# EAGLE design canmotor (EAGLE 9.6.2)
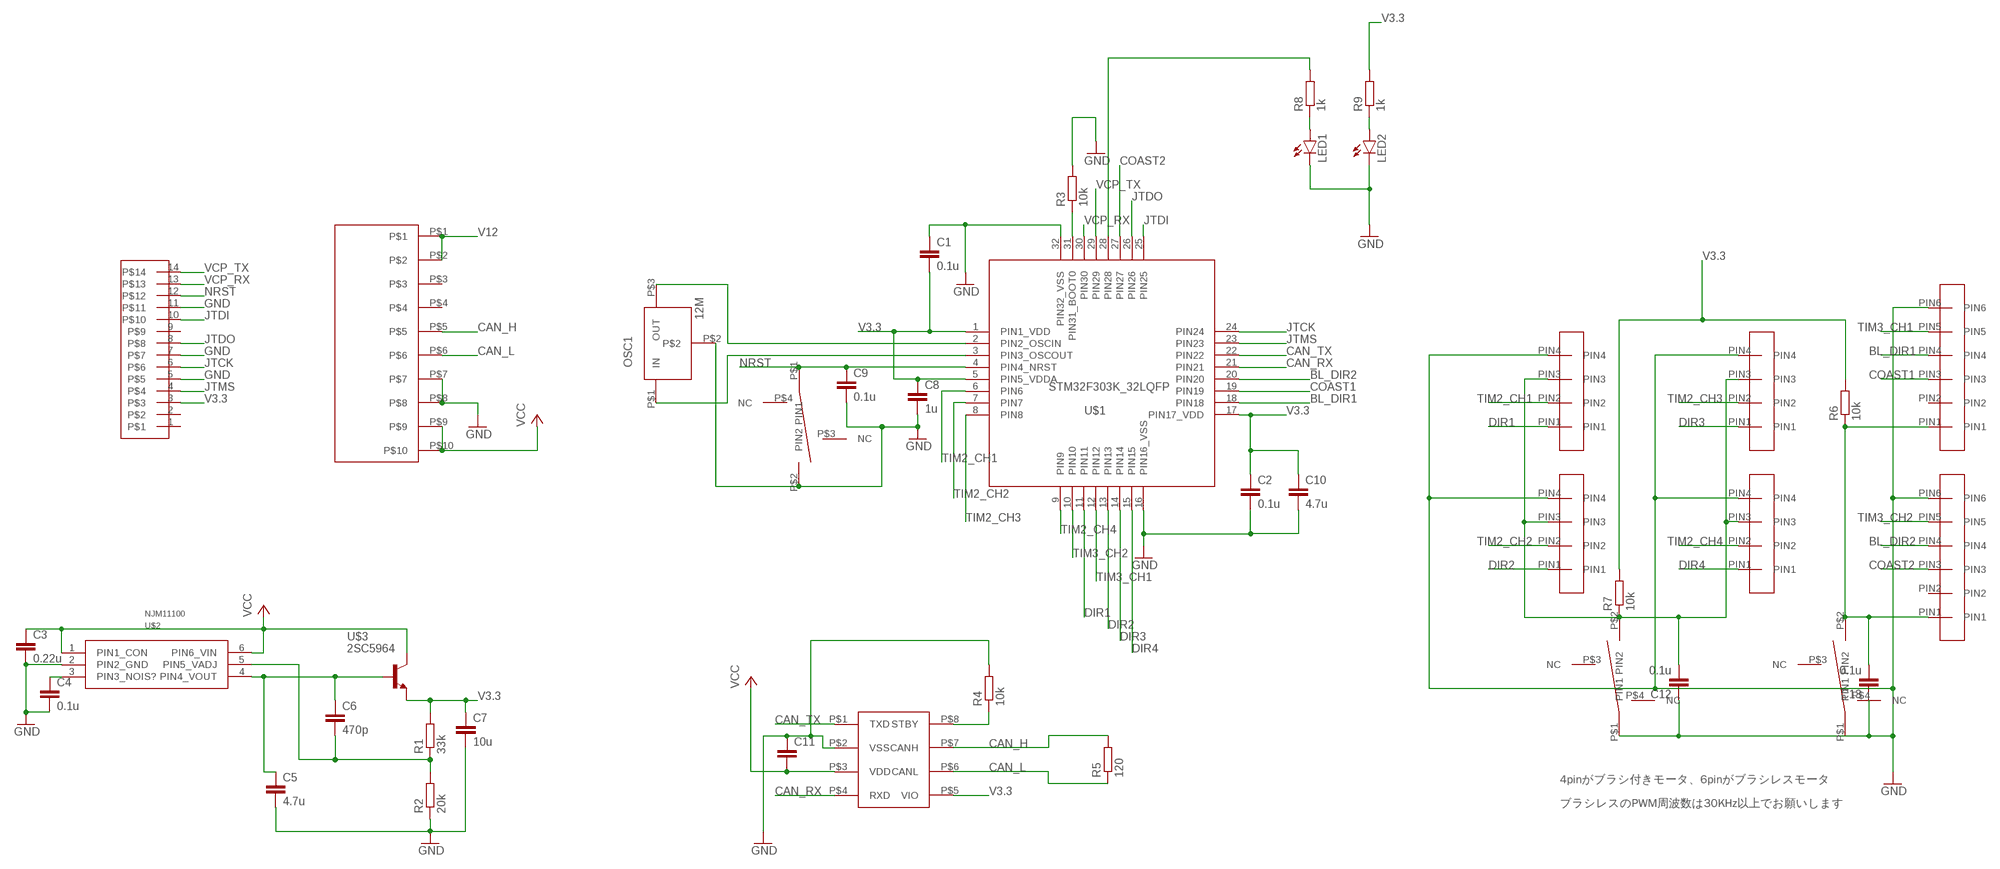
[diagram p0: schematic, sheet 1]

## Parts
BOX10P-L2  BOX10PBOX10P-L  [BOX10P-L]
C1  0.1u  C-EUC1608  [C1608]
C2  0.1u  C-EUC1608  [C1608]
C3  0.22u  C-EUC2012  [C2012]
C4  0.1u  C-EUC1608  [C1608]
C5  4.7u  C-EUC2012  [C2012]
C6  470p  C-EUC1608  [C1608]
C7  10u  C-EUC2012  [C2012]
C8  1u  C-EUC1608  [C1608]
C9  0.1u  C-EUC1608  [C1608]
C10  4.7u  C-EUC2012  [C2012]
C11  C-EUC1608  [C1608]
C12  0.1u  C-EUC1608  [C1608]
C13  0.1u  C-EUC1608  [C1608]
LED1  1608LED  [1608]
LED2  1608LED  [1608]
OSC1  12M  CSTN#  [CSTNE#]
R1  33k  R_REG  [1608]
R2  20k  R_REG  [1608]
R3  10k  R_REG  [1608]
R4  10k  R_REG  [1608]
R5  120  R_REG  [1608]
R6  10k  R_REG  [1608]
R7  10k  R_REG  [1608]
R8  1k  R_REG  [1608]
R9  1k  R_REG  [1608]
U$1  STM32F303K_32LQFP  [LQFP32-7X7]
U$2  NJM11100  [SOT23-6]
U$3  2SC5964  [PCP]
U$4  TAKUTOSUITTI2  [TAKUTOSUITTI2]
U$5  MCP2562MCP2561-SN  [SOIC8]
U$6  BOX14P  [CON_HEDA14P_1.27]
U$7  DF1B_L_6P  [DF1B_L_6P]
U$8  DF1B_L_4P  [DF1B_L_4P]
U$9  DF1B_L_4P  [DF1B_L_4P]
U$10  DF1B_L_4P  [DF1B_L_4P]
U$11  DF1B_L_4P  [DF1B_L_4P]
U$12  DF1B_L_6P  [DF1B_L_6P]
U$13  TAKUTOSUITTI2  [TAKUTOSUITTI2]
U$14  TAKUTOSUITTI2  [TAKUTOSUITTI2]

## Nets
BL_DIR1: U$1.18(PIN18) U$7.PIN4
BL_DIR2: U$1.20(PIN20) U$12.PIN4
CAN_H: BOX10P-L2.P$5 R5.2 U$5.P$7(CANH)
CAN_L: BOX10P-L2.P$6 R5.1 U$5.P$6(CANL)
CAN_RX: U$1.21(PIN21) U$5.P$4(RXD)
CAN_TX: U$1.22(PIN22) U$5.P$1(TXD)
COAST1: U$1.19(PIN19) U$7.PIN3
COAST2: U$1.27(PIN27) U$12.PIN3
DIR1: U$1.11(PIN11) U$8.PIN1
DIR2: U$1.13(PIN13) U$9.PIN1
DIR3: U$1.14(PIN14) U$10.PIN1
DIR4: U$1.15(PIN15) U$11.PIN1
GND: BOX10P-L2.P$7 BOX10P-L2.P$8 C1.1 C2.2 C3.2 C4.2 C5.2 C7.2 C8.2 C9.2 C10.2 C11.1 C12.1 C13.1 LED1.K LED2.K OSC1.P$2 R2.1 R3.2 R4.2 U$1.16(PIN16_VSS) U$1.32(PIN32_VSS) U$2.2(PIN2_GND) U$4.P$2(PIN2) U$5.P$2(VSS) U$6.5 U$6.7 U$6.11 U$7.PIN6 U$8.PIN4 U$9.PIN4 U$10.PIN4 U$11.PIN4 U$12.PIN6 U$13.P$1(PIN1) U$14.P$1(PIN1)
JTCK: U$1.24(PIN24) U$6.6
JTDI: U$1.25(PIN25) U$6.10
JTDO: U$1.26(PIN26) U$6.8
JTMS: U$1.23(PIN23) U$6.4
N$1: C6.2 R1.1 R2.2 U$2.5(PIN5_VADJ)
N$2: C4.1 U$2.3(PIN3_NOIS?)
N$3: C5.1 C6.1 U$2.4(PIN4_VOUT) U$3.1(B)
N$4: OSC1.P$1(IN) U$1.3(PIN3_OSCOUT)
N$5: OSC1.P$3(OUT) U$1.2(PIN2_OSCIN)
N$6: R3.1 U$1.31(PIN31_BOOT0)
N$7: C12.2 R7.1 U$8.PIN3 U$9.PIN3 U$10.PIN3 U$11.PIN3 U$14.P$2(PIN2)
N$9: R4.1 U$5.P$8(STBY)
N$10: C13.2 R6.1 U$7.PIN1 U$12.PIN1 U$13.P$2(PIN2)
N$11: LED1.A R8.1
N$12: LED2.A R9.1
N$14: R8.2 U$1.28(PIN28)
NRST: C9.1 U$1.4(PIN4_NRST) U$4.P$1(PIN1) U$6.12
TIM2_CH1: U$1.6(PIN6) U$8.PIN2
TIM2_CH2: U$1.7(PIN7) U$9.PIN2
TIM2_CH3: U$1.8(PIN8) U$10.PIN2
TIM2_CH4: U$1.9(PIN9) U$11.PIN2
TIM3_CH1: U$1.12(PIN12) U$7.PIN5
TIM3_CH2: U$1.10(PIN10) U$12.PIN5
V3.3: C1.2 C2.1 C7.1 C8.1 C10.1 R1.2 R6.2 R7.2 R9.2 U$1.1(PIN1_VDD) U$1.5(PIN5_VDDA) U$1.17(PIN17_VDD) U$3.3(E) U$5.P$5(VIO) U$6.3
V12: BOX10P-L2.P$1 BOX10P-L2.P$2
VCC: BOX10P-L2.P$9 BOX10P-L2.P$10 C3.1 C11.2 U$2.1(PIN1_CON) U$2.6(PIN6_VIN) U$3.2(C) U$3.2@2(C) U$5.P$3(VDD)
VCP_RX: U$1.30(PIN30) U$6.13
VCP_TX: U$1.29(PIN29) U$6.14
Unconnected: BOX10P-L2.P$3 BOX10P-L2.P$4 U$4.P$3(NC) U$4.P$4(NC) U$6.1 U$6.2 U$6.9 U$7.PIN2 U$12.PIN2 U$13.P$3(NC) U$13.P$4(NC) U$14.P$3(NC) U$14.P$4(NC)

## Notes on the sheet
- 4pinがブラシ付きモータ、6pinがブラシレスモータ
- ブラシレスのPWM周波数は30KHz以上でお願いします

## Library data of the parts
BOX10P-L2 = user_conector:BOX10P
C1-C13 = rcl:C-EU: CAPACITOR, European symbol; SPICEPREFIX: C
LED1 LED2 = user_leds:1608LED: 1608LED
OSC1 = user_osc:CSTN#: ムラタのセラロック （セラミック振動子） 周波数はいくつか種類あり(valueで設定して) 秋月電子通商のトップ/パーツ一般/発振子/セラミック発振子 uCからのoutが入るのがinであることに注意 https://akizukidenshi.com/catalog/c/cceralock/
R1-R9 = user_rcl:R_REG: 1608パッケージのチップ抵抗 ガッコのリールの抵抗はたぶんこれ
U$1 = user_ic:STM32F303K_32LQFP
U$2 = user_ic:NJM11100: 可変型レギュレータ 秋月電子[I-06655]
U$3 = user_tr_fet_igbt:2SC5964: rs品番774-0746 PCP
U$4 U$13 U$14 = user_swich:TAKUTOSUITTI2
U$5 = user_ic:MCP2562
U$6 = user_conector:BOX14P
U$7 U$12 = user_conector:DF1B_L_6P
U$8-U$11 = user_conector:DF1B_L_4P

## Board
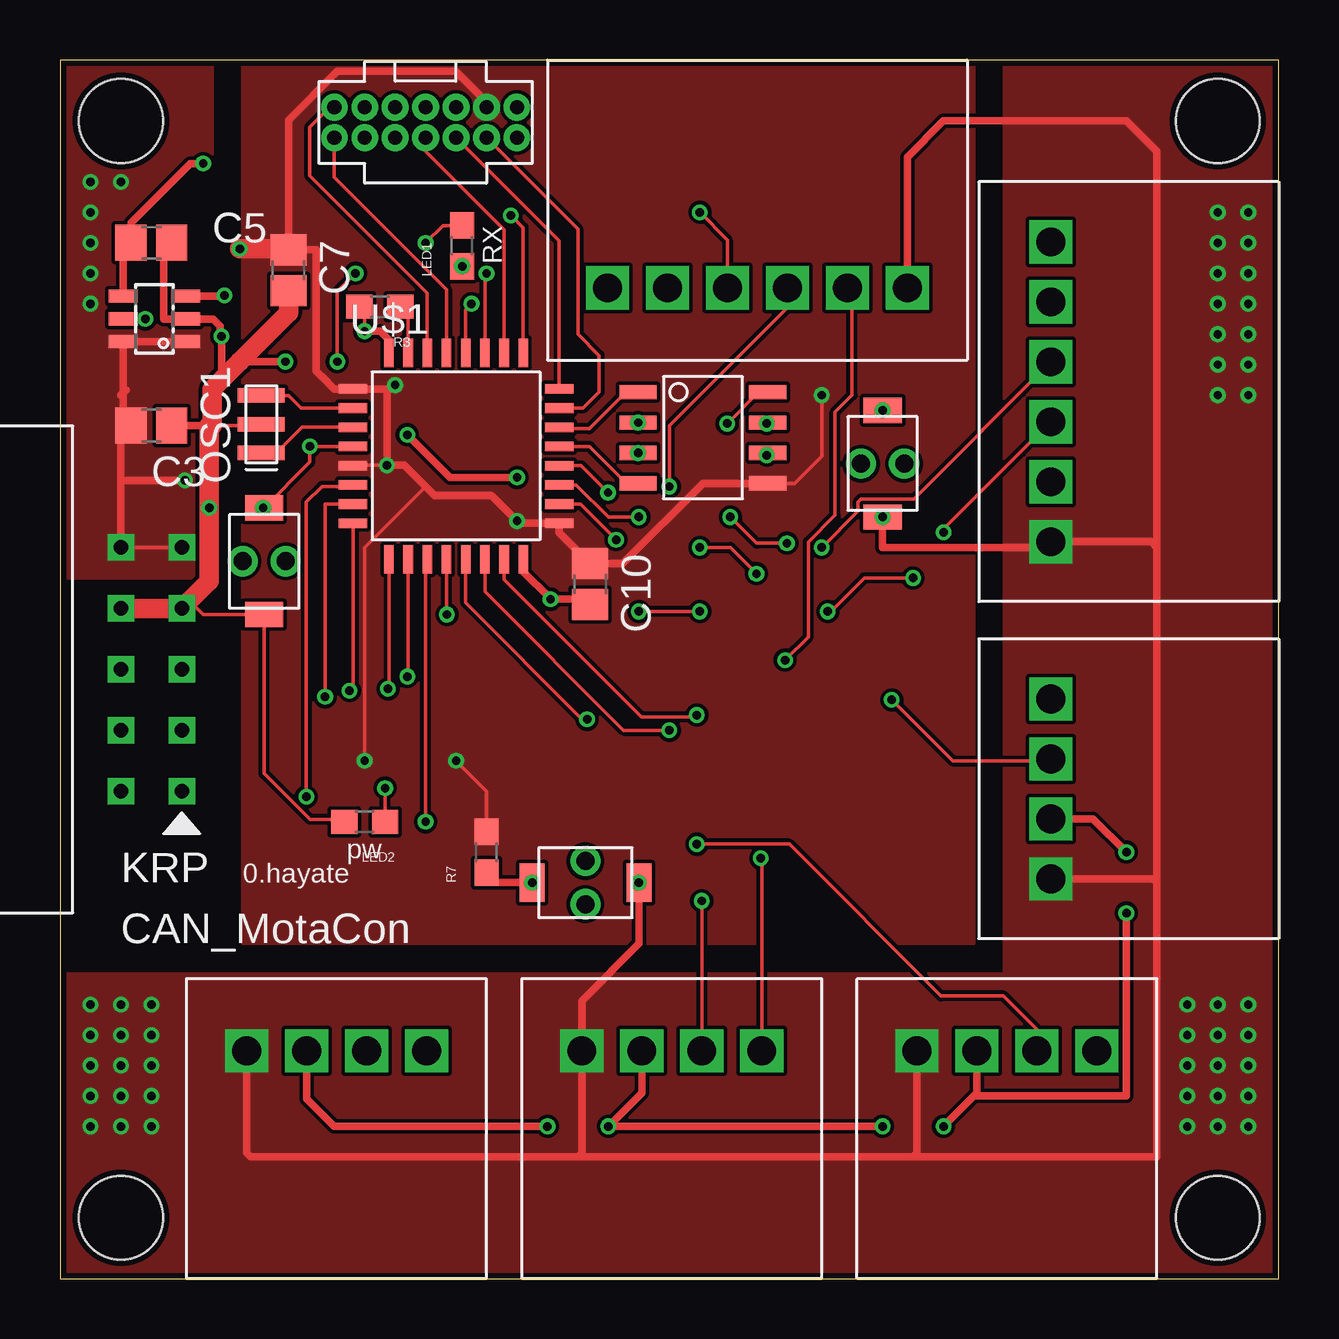
[diagram p1: board, top side]
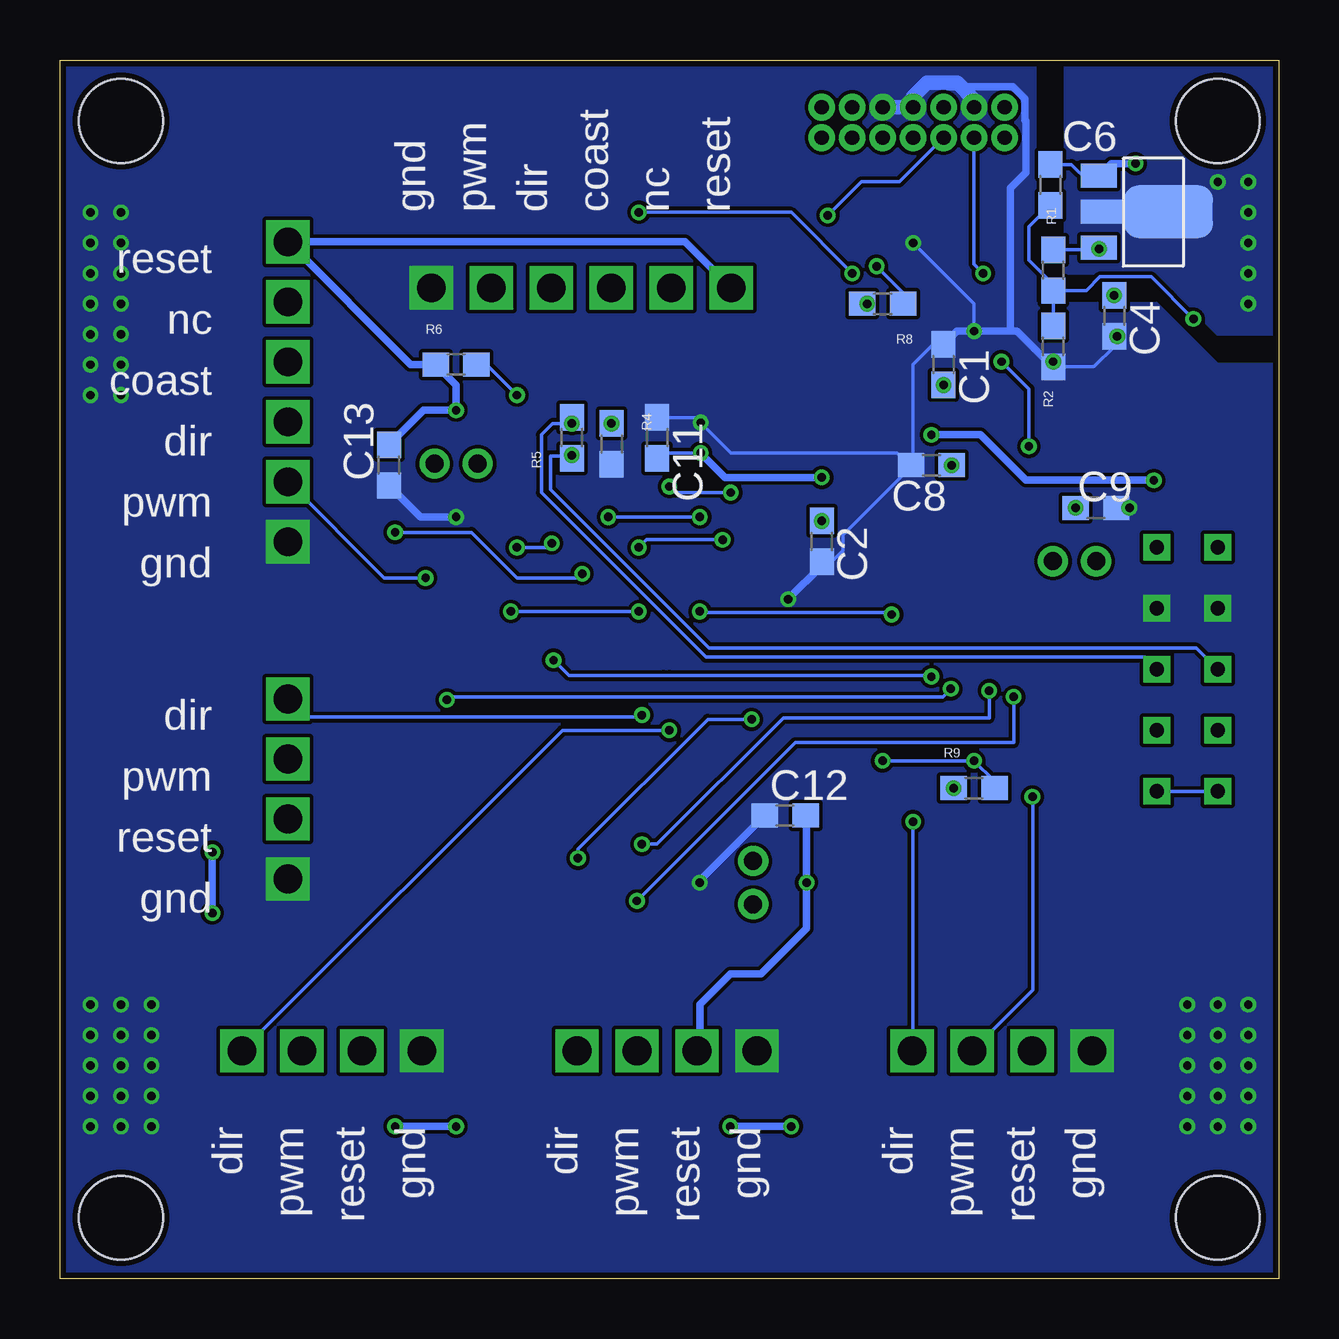
[diagram p2: board, bottom side, seen from below]

Size 50.8 x 50.8 mm. Coordinates in mm from the lower left corner, seen from the top.
Outline: 0,0 50.8,0 50.8,50.8 0,50.8 0,0
Copper layers (1*16): Top 0.035mm / dielectric 1.5mm / Bottom 0.035mm
Design rules "SeeedStudio_2layer_DRU_no_angle_20140221": minimum track width 6mil, minimum drill 12mil, track to track 6mil, track to pad 6mil, pad to pad 6mil, via to via 6mil, smd to smd 0mil, copper to edge 10mil, drill to drill 10mil, minimum pad ring 10mil, minimum via ring 6mil, stop-mask expansion 2mil, vias tented up to drill 100mil, thermal gap 10mil
Holes 3.5 mm at 2.54,48.26 48.26,48.26 48.26,2.54 2.54,2.54

### Footprints (pad centres in the part's own frame; a part is rotated, then mirrored left to right if it is on the bottom)
BOX10P-L = drill 0.6 square: P$1 5.08,2.54; P$2 5.08,0; P$3 2.54,2.54; P$4 2.54,0; P$5 0,2.54; P$6 0,0; P$7 -2.54,2.54; P$8 -2.54,0; P$9 -5.08,2.54; P$10 -5.08,0
C1608 = smd 1.1 x 1: 1 -0.85,0; 2 0.85,0
C2012 = smd 1.3 x 1.5: 1 -0.85,0; 2 0.85,0
1608 = smd 1.1 x 1: A -0.85,0; K 0.85,0
CSTNE# = smd 0.6 x 1.95: P$1 0,0; P$2 1.2,0; P$3 2.4,0
1608' = smd 1.1 x 1: 1 -0.85,0; 2 0.85,0
LQFP32-7X7 = smd 1.2 x 0.4: 1 -4.3,2.8; 2 -4.3,2; 3 -4.3,1.2; 4 -4.3,0.4; 5 -4.3,-0.4; 6 -4.3,-1.2; 7 -4.3,-2; 8 -4.3,-2.8; 17 4.3,-2.8; 18 4.3,-2; 19 4.3,-1.2; 20 4.3,-0.4; 21 4.3,0.4; 22 4.3,1.2; 23 4.3,2; 24 4.3,2.8 | smd 0.4 x 1.2: 9 -2.8,-4.3; 10 -2,-4.3; 11 -1.2,-4.3; 12 -0.4,-4.3; 13 0.4,-4.3; 14 1.2,-4.3; 15 2,-4.3; 16 2.8,-4.3; 25 2.8,4.3; 26 2,4.3; 27 1.2,4.3; 28 0.4,4.3; 29 -0.4,4.3; 30 -1.2,4.3; 31 -2,4.3; 32 -2.8,4.3
SOT23-6 = smd 0.55 x 1.2: 1 -0.95,-1.3; 2 0,-1.3; 3 0.95,-1.3; 4 0.95,1.3; 5 0,1.3; 6 -0.95,1.3
PCP = smd 1 x 1.5: 1 0,0; 3 3,0 | smd 1 x 1.8: 2 1.5,0.15 | smd 2.2 x 3.7: 2@2 1.5,2.9
TAKUTOSUITTI2 = smd 1.05 x 1.6: P$1 0,0; P$2 4.45,0 | drill 0.75: P$3 2.225,-0.9; P$4 2.225,0.9
SOIC8 = smd 1.55 x 0.6: P$1 -2.7,1.905; P$2 -2.7,0.635; P$3 -2.7,-0.635; P$4 -2.7,-1.905; P$5 2.7,-1.905; P$6 2.7,-0.635; P$7 2.7,0.635; P$8 2.7,1.905
CON_HEDA14P_1.27 = drill 0.6: 1 1.08,8.255; 2 2.35,8.255; 3 1.08,6.985; 4 2.35,6.985; 5 1.08,5.715; 6 2.35,5.715; 7 1.08,4.445; 8 2.35,4.445; 9 1.08,3.175; 10 2.35,3.175; 11 1.08,1.905; 12 2.35,1.905; 13 1.08,0.635; 14 2.35,0.635
DF1B_L_6P = drill 1.2 square: PIN1 2.5,-9.5; PIN2 5,-9.5; PIN3 7.5,-9.5; PIN4 10,-9.5; PIN5 12.5,-9.5; PIN6 15,-9.5
DF1B_L_4P = drill 1.2 square: PIN1 2.5,-9.5; PIN2 5,-9.5; PIN3 7.5,-9.5; PIN4 10,-9.5

### Placement (x,y rotation side)
BOX10P-L2  2.54,25.4 270 top
C1  13.97,38.1 270 bottom
C2  19.05,30.73 270 bottom
C3  3.81,35.56 0 top
C4  6.86,40.13 270 bottom
C5  3.81,43.18 0 top
C6  9.53,45.59 270 bottom
C7  9.53,42.04 270 top
C8  14.48,33.91 180 bottom
C9  7.62,32.13 0 bottom
C10  22.1,28.96 270 top
C11  25.91,35.05 270 bottom
C12  20.57,19.3 0 bottom
C13  37.08,33.91 90 bottom
LED1  16.76,43.05 90 top
LED2  12.7,19.05 180 top
OSC1  8.38,34.42 90 top
R1  33k  [1608']  9.4,42.04 90 bottom
R2  20k  [1608']  9.4,38.86 90 bottom
R3  10k  [1608']  13.34,40.51 180 top
R4  10k  [1608']  27.81,34.8 270 bottom
R5  120  [1608']  29.46,35.05 90 bottom
R6  10k  [1608']  34.29,38.1 0 bottom
R7  10k  [1608']  17.78,17.78 90 top
R8  1k  [1608']  16.51,40.64 180 bottom
R9  1k  [1608']  12.7,20.45 0 bottom
U$1  16.51,34.29 0 top
U$2  3.94,40.01 90 top
U$3  7.49,45.97 270 bottom
U$4  8.51,32.13 270 top
U$5  26.8,35.05 0 top
U$6  10.79,49.91 270 top
U$7  50.8,45.72 270 top
U$8  17.78,0 180 top
U$9  31.75,0 180 top
U$10  45.72,0 180 top
U$11  50.8,26.67 270 top
U$12  20.32,50.8 0 top
U$13  34.29,31.75 90 top
U$14  24.13,16.51 180 top

### Tracks (layer width: path | path; a pad name or v marks a point on that pad's centre or on a via)
BL_DIR1  (via drill 0.35)
  Top 0.152: U$7.PIN4 36.83,31.25 v36.83,31.11 | U$1.18 21.69,32.29 v23.18,30.8 | v26.67,30.48 27.94,30.48 v29.03,29.39
  Bottom 0.152: v36.83,31.11 33.65,31.11 31.75,29.21 29.21,29.21 v29.03,29.39 | v23.18,30.8 26.35,30.8 v26.67,30.48
BL_DIR2  (via drill 0.35)
  Top 0.152: U$1.20 21.72,33.89 v22.84,32.77 | v25.4,33.02 25.4,35.56 30.32,40.48 U$12.PIN4
  Bottom 0.152: v22.84,32.77 25.15,32.77 v25.4,33.02
CAN_H  (via drill 0.35)
  Top 0.152: U$5.P$7 v29.46,35.65
  Bottom 0.152: BOX10P-L2.P$5 5.59,25.91 23.88,25.91 30.73,32.77 30.73,35.18 30.27,35.65 v29.46,35.65 R5.2
CAN_L  (via drill 0.35)
  Top 0.152: U$5.P$6 29.5,34.36 v29.46,34.33
  Bottom 0.152: BOX10P-L2.P$6 3.43,26.29 23.75,26.29 30.35,32.89 30.35,34.29 29.5,34.29 | v29.46,34.33 29.5,34.29 | R5.1 29.46,34.25 29.5,34.29
CAN_RX
  Top 0.152: U$5.P$4 23.62,33.15 22.08,34.69 U$1.21
CAN_TX
  Top 0.152: U$1.22 20.87,35.43 22.07,35.43 23.59,36.96 U$5.P$1
COAST1  (via drill 0.35)
  Top 0.152: U$7.PIN3 35.58,32.5 33.4,32.5 33.26,32.37 33.26,31.99 v31.75,30.48 | v30.3,30.66 29.03,30.66 v27.94,31.75 | v24.13,31.75 22.86,31.75 21.52,33.09 U$1.19
  Bottom 0.152: v31.75,30.48 30.48,30.48 v30.3,30.66 | v27.94,31.75 v24.13,31.75
COAST2  (via drill 0.35)
  Top 0.152: U$1.27 17.71,41.84 v17.78,41.91 | v26.67,44.45 27.82,43.3 U$12.PIN3
  Bottom 0.152: v17.78,41.91 20.32,44.45 v26.67,44.45
DIR1  (via drill 0.35)
  Top 0.152: v15.24,19.05 15.24,29.92 U$1.11
  Bottom 0.152: U$8.PIN1 15.24,9.54 v15.24,19.05
DIR2  (via drill 0.35)
  Top 0.152: U$9.PIN1 29.25,17.49 v29.21,17.53 | v21.97,23.32 21.77,23.32 16.91,28.18 U$1.13
  Bottom 0.152: v29.21,17.53 29.21,17.91 23.8,23.32 v21.97,23.32
DIR3  (via drill 0.35)
  Top 0.152: U$1.14 17.71,28.64 23.5,22.86 v25.4,22.86
  Bottom 0.152: v25.4,22.86 29.86,22.86 U$10.PIN1
DIR4  (via drill 0.35)
  Top 0.152: U$1.15 18.51,29.14 24.23,23.42 26.47,23.42 v26.54,23.5
  Bottom 0.152: v26.54,23.5 26.63,23.41 40.54,23.41 U$11.PIN1
GND  (via drill 0.35)
  Top 0.152: R3.2 12.7,40.3 v12.7,39.5 | BOX10P-L2.P$7 5.39,28.25 5.97,27.68 U$4.P$2 8.51,21.06 10.42,19.15 11.75,19.15 LED2.K | OSC1.P$2 8.32,35.56 6.35,35.56 | LED1.K 15.96,43.9 v15.24,43.18
  Top 0.305: U$1.32 13.71,39.12 13.34,39.5 v12.7,39.5 | U$1.16 19.31,29.48 20.45,28.34 v20.45,28.32 21.88,28.32 C10.2 | C3.2 6.22,35.56 6.35,35.56 | C5.2 4.32,42.84 4.32,40.01 U$2.2 6.39,40.01 6.69,39.71 6.69,39.33 v6.73,39.28 6.73,37.21 6.35,36.83 | v9.4,38.23 7.49,38.23 | U$8.PIN4 7.78,5.24 7.94,5.08 21.59,5.08 | 21.59,5.08 21.75,5.24 U$9.PIN4 21.75,11.59 24.13,13.97 U$14.P$1 | U$10.PIN4 35.72,5.24 35.56,5.08 | 35.56,5.08 21.59,5.08 | 35.56,5.08 45.72,5.08 45.72,16.51 | 45.72,16.51 45.56,16.67 U$11.PIN4 | 45.72,16.51 45.72,30.48 | 45.72,30.48 45.48,30.72 U$7.PIN6 41.06,30.48 34.29,30.48 U$13.P$1 | 45.72,30.48 45.72,46.99 44.45,48.26 36.83,48.26 35.32,46.75 U$12.PIN6
  Top 0.813: BOX10P-L2.P$8 BOX10P-L2.P$7 6.22,29.08 v6.22,32.13 6.22,35.56 | 6.35,35.56 6.35,36.83 6.35,37.08 7.49,38.23 9.53,40.26 C7.2
  Bottom 0.152: C1.1 14.39,38.95 15.24,38.1 15.24,34 C8.2 15.33,33.82 | 15.33,33.82 18.16,30.99 18.16,30.35 18.63,29.88 C2.2 | R2.1 7.71,38.01 6.86,38.86 C4.2 | C11.1 24.26,35.9 24.1,35.74 U$5.P$2 22.83,34.42 15.92,34.42 15.33,33.82 | v6.22,32.13 C9.2 | v15.24,43.18 12.7,40.64 v12.7,39.5
  Bottom 0.305: C2.2 19.05,29.72 v20.45,28.32 | C1.1 13.42,39.5 v12.7,39.5 11.18,39.5 | v9.4,38.23 9.65,38.23 10.92,39.5 11.18,39.5 | 13.97,49.84 13.82,49.69 11.07,49.69 10.57,49.19 10.57,48.29 10.54,48.26 10.54,46.1 11.18,45.47 11.18,39.5 | C12.1 24.13,16.6 U$14.P$1 | C13.1 35.77,31.75 U$13.P$1
  Bottom 0.61: U$6.5 U$6.7 15.24,49.28 14.67,49.84 13.97,49.84 13.39,49.84 12.7,49.15 U$6.11
  other vias: 24.1,35.69 24.13,16.51 34.29,31.75 1.27,11.43 2.54,11.43 3.81,11.43 1.27,10.16 2.54,10.16 3.81,10.16 3.81,8.89 2.54,8.89 1.27,8.89 1.27,7.62 2.54,7.62 3.81,7.62 3.81,6.35 2.54,6.35 1.27,6.35 46.99,6.35 48.26,6.35 49.53,6.35 49.53,7.62 48.26,7.62 46.99,7.62 46.99,8.89 48.26,8.89 49.53,8.89 49.53,10.16 48.26,10.16 46.99,10.16 46.99,11.43 48.26,11.43 49.53,11.43 48.26,44.45 49.53,44.45 49.53,43.18 48.26,43.18 48.26,41.91 49.53,41.91 49.53,40.64 48.26,40.64 48.26,39.37 49.53,39.37 49.53,38.1 48.26,38.1 48.26,36.83 49.53,36.83
  pour Bottom (no thermals): 0,0 50.8,0 50.8,50.8 10.16,50.8 10.16,40.64 5.08,40.64 2.54,38.1 0,38.1
  pour Top (no thermals): 0,12.7 39.37,12.7 39.37,50.8 50.8,50.8 50.8,0 0,0
JTCK
  Top 0.152: U$6.6 20.81,43.26 U$1.24
JTDI  (via drill 0.35)
  Top 0.152: U$1.25 19.3,43.81 v18.8,44.32
  Bottom 0.152: U$6.10 15.81,45.72 17.4,45.72 v18.8,44.32
JTDO
  Top 0.152: U$1.26 18.51,43.72 15.24,46.99 U$6.8
JTMS
  Top 0.152: U$1.23 21.81,36.29 22.48,36.96 22.48,38.48 21.59,39.37 21.59,43.75 U$6.4
N$1  (via drill 0.35)
  Top 0.305: U$2.5 v3.56,40.01
  Bottom 0.152: C6.2 10.41,43.85 10.41,42.46 9.4,41.44 R1.1 | R1.1 R2.2 | R1.1 8.03,41.19 7.45,41.76 5.31,41.76 v3.56,40.01
N$2  (via drill 0.35)
  Top 0.305: U$2.3 6.83,40.95 C4.1
  other vias: 6.86,40.98
N$3  (via drill 0.35)
  Top 0.305: U$2.4 2.64,42.86 C5.1 2.96,44.02 5.42,46.48 v5.97,46.48
  Bottom 0.152: U$3.1 7.75,45.72 7.91,45.72 8.64,46.44 C6.1
  Bottom 0.305: v5.97,46.48 6.99,46.48 U$3.1
N$4
  Top 0.152: U$1.3 10.09,35.49 9.02,34.42 OSC1.P$1
N$5
  Top 0.152: U$1.2 10.05,36.29 9.53,36.82 OSC1.P$3
N$6
  Top 0.152: U$1.31 14.51,40.19 R3.1
N$7  (via drill 0.35)
  Top 0.305: v20.32,6.35 11.43,6.35 10.28,7.5 U$8.PIN3 | U$9.PIN3 24.25,7.74 v22.86,6.35 v34.29,6.35 | U$10.PIN3 38.22,7.74 v36.83,6.35 38.1,7.62 44.45,7.62 v44.45,15.24 | v44.45,17.78 43.06,19.17 U$11.PIN3 | U$14.P$2 18.2,16.51 R7.1
  Bottom 0.305: v20.32,6.35 v22.86,6.35 | v34.29,6.35 v36.83,6.35 | v44.45,15.24 v44.45,17.78 | C12.2 19.68,19.26 U$14.P$2 19.68,14.61 21.59,12.7 22.86,12.7 24.13,11.43 24.13,9.62 U$9.PIN3
  other vias: 19.68,16.51
N$9  (via drill 0.35)
  Top 0.152: U$5.P$8 29.12,36.96 R4.1
  other vias: 27.81,35.65
N$10  (via drill 0.35)
  Bottom 0.305: U$12.PIN1 24.74,43.22 U$7.PIN1 36.18,38.1 R6.1 34.29,37.25 U$13.P$2 35.64,36.2 C13.2
  other vias: 34.29,36.2
N$11  (via drill 0.35)
  Bottom 0.152: R8.1 15.66,41.1 LED1.A
  other vias: 16.76,42.2
N$12  (via drill 0.35)
  Top 0.152: LED2.A R9.1
  other vias: 13.55,20.45
N$14  (via drill 0.35)
  Top 0.152: U$1.28 16.91,40.4 v17.15,40.64
  Bottom 0.152: v17.15,40.64 R8.2
NRST  (via drill 0.35)
  Top 0.152: U$1.4 v10.41,34.69 10.41,34.04 U$4.P$1 C9.1 | v12.32,41.91 11.56,41.15 v11.56,38.23
  Bottom 0.152: v11.56,38.23 10.41,37.08 v10.41,34.69 | v12.32,41.91 12.7,42.29 U$6.12
  other vias: 8.47,32.13
TIM2_CH1  (via drill 0.35)
  Top 0.152: U$1.6 12.14,33.02 10.92,33.02 10.27,32.37 v10.27,20.09
  Bottom 0.152: v10.27,20.09 10.24,20.06 10.24,12.04 U$8.PIN2
TIM2_CH2  (via drill 0.35)
  Top 0.152: U$1.7 11.05,32.29 v11.05,24.26 | U$9.PIN2 v26.75,15.75
  Bottom 0.152: v11.05,24.26 11.05,22.35 20.15,22.35 v26.75,15.75
TIM2_CH3  (via drill 0.35)
  Top 0.152: U$1.8 12.21,24.66 v12.06,24.51 | v26.54,18.11 30.4,18.11 36.73,11.79 39.32,11.79 40.72,10.39 U$10.PIN2
  Bottom 0.152: v12.06,24.51 12.06,23.37 20.65,23.37 25.91,18.11 v26.54,18.11
TIM2_CH4  (via drill 0.35)
  Top 0.152: v13.67,24.59 13.71,24.63 U$1.9 | v34.67,24.13 37.21,21.59 41.22,21.59 U$11.PIN2
  Bottom 0.152: v34.67,24.13 34.54,24.26 14,24.26 v13.67,24.59
TIM3_CH1  (via drill 0.35)
  Top 0.152: v35.56,29.21 33.53,29.21 32.13,27.81 v32,27.81 | v26.67,27.81 v24.13,27.81 | v16.13,27.69 16.13,27.94 16.11,27.96 U$1.12
  Bottom 0.152: U$7.PIN5 37.29,29.21 v35.56,29.21 | v32,27.81 v26.67,27.81 | v16.13,27.69 16.21,27.77 24.08,27.77 v24.13,27.81
TIM3_CH2  (via drill 0.35)
  Top 0.152: U$1.10 14.51,25.13 v14.48,25.1 | U$12.PIN5 33.02,41.1 33.02,36.83 32.31,36.12 32.31,31.82 31.19,30.71 31.19,26.75 v30.23,25.78
  Bottom 0.152: v14.48,25.1 14.53,25.15 25.4,25.15 25.65,25.15 29.59,25.15 v30.23,25.78
V3.3  (via drill 0.35)
  Top 0.152: C8.1 12.23,33.91 U$1.5 | U$5.P$5 30.61,33.15 31.75,34.29 v31.75,36.83 | R7.2 17.78,20.32 v16.51,21.59 | v12.7,21.59 12.7,30.48 15.24,33.02
  Top 0.305: 13.59,37.09 U$1.1 11.43,37.09 10.93,37.59 10.91,37.59 10.67,37.84 10.67,42.89 C7.1 9.53,48.29 11.56,50.33 16.48,50.33 17.78,49.03 U$6.3 | 13.59,37.09 13.81,37.09 C1.2 | U$5.P$5 26.8,33.15 23.46,29.81 C10.1 20.81,31.09 U$1.17 19.14,31.49 C2.1 18,32.64 15.62,32.64 15.24,33.02 14.35,33.91 C8.1 13.63,37.05 13.59,37.09
  Top 0.813: C7.1 9.49,42.93 v7.49,42.93
  Bottom 0.152: R1.2 7.58,42.89 U$3.3 v7.49,42.93 | v31.75,36.83 33.02,38.1 R6.2 | v16.51,21.59 v12.7,21.59 11.85,20.74 R9.2
  other vias: 13.97,37.25 19.05,31.58 13.63,33.91
  pour Top (no thermals): 38.1,50.8 38.1,13.97 7.62,13.97 7.62,50.8
V12
  Bottom 0.152: BOX10P-L2.P$1 BOX10P-L2.P$2
VCC  (via drill 0.35)
  Top 0.152: C3.1 2.54,35.98 | 2.75,37.04 2.64,37.15 | BOX10P-L2.P$10 BOX10P-L2.P$9
  Top 0.305: U$2.1 U$2.6 2.64,37.15 2.64,35.88 C3.1 | v19.05,33.4 16.26,33.4 v14.48,35.18 | BOX10P-L2.P$10 2.54,33.27 | 2.54,33.27 2.54,35.98 | 2.54,36.83 2.75,37.04 | v5.21,33.27 2.54,33.27
  Bottom 0.152: U$5.P$3 25.69,34.42 C11.2
  Bottom 0.305: U$5.P$3 23.08,33.4 v19.05,33.4 | v14.48,35.18 12.43,35.18 10.55,33.3 5.23,33.3 v5.21,33.27
  other vias: 24.1,34.42 1.27,45.72 1.27,44.45 1.27,43.18 1.27,41.91 1.27,40.64 2.54,45.72
  pour Bottom (no thermals): 0,50.8 8.89,50.8 8.89,41.91 5.08,41.91 2.54,39.37 0,39.37
  pour Top (no thermals): 0,29.21 6.35,29.21 6.35,50.8 0,50.8
VCP_RX
  Top 0.152: U$1.30 15.31,41.08 10.41,45.97 10.41,48.01 11.24,48.83 U$6.13
VCP_TX
  Top 0.152: U$6.14 11.43,45.91 16.11,41.23 U$1.29

### Text on the board
tPlace: RX | pw | KRP | 0.hayate | CAN_MotaCon
bPlace: reset | nc | coast | dir | pwm | gnd | reset | nc | coast | dir | pwm | gnd | dir | pwm | reset | gnd | gnd | reset | pwm | dir | gnd | reset | pwm | dir | gnd | reset | pwm | dir